# Altium schematic sheet OffsetAmplifier.SchDoc
size 193 x 146 mm; DocumentNumber: 7; SheetNumber: 7; SheetTotal: 11
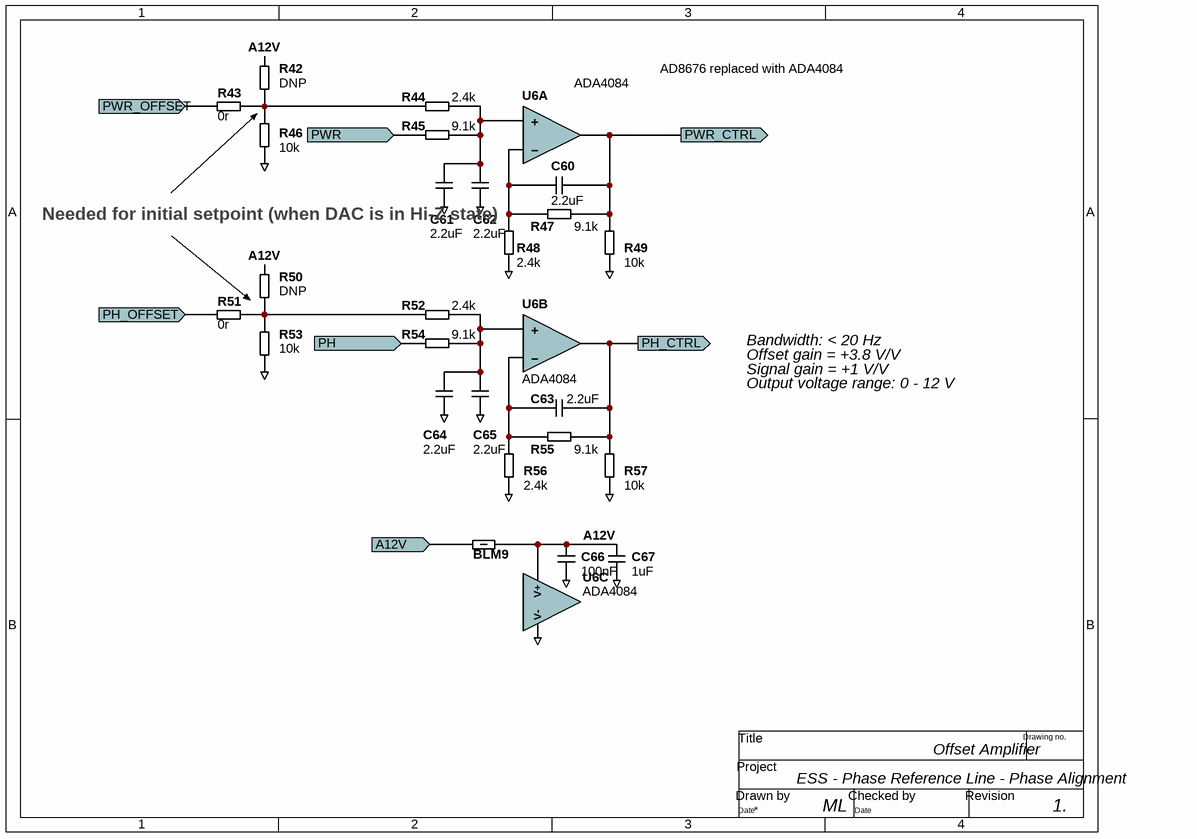
[diagram p0: OffsetAmplifier.SchDoc]

## Parts
BLM9  120 Ohms @ 100MHz  [0402-Inductor]  (value not drawn)
C60  2.2uF  [0805-Capacitor]
C61  2.2uF  [0805-Capacitor]
C62  2.2uF  [0805-Capacitor]
C63  2.2uF  [0805-Capacitor]
C64  2.2uF  [0805-Capacitor]
C65  2.2uF  [0805-Capacitor]
C66  100nF  [0402-Capacitor]
C67  1uF  [0805-Capacitor]
R42  DNP  [0402-RESISTOR]  (no BOM)
R43  0r  [0402-RESISTOR]
R44  2.4k  [0402-RESISTOR]
R45  9.1k  [0402-RESISTOR]
R46  10k  [0402-RESISTOR]
R47  9.1k  [0402-RESISTOR]
R48  2.4k  [0402-RESISTOR]
R49  10k  [0402-RESISTOR]
R50  DNP  [0402-RESISTOR]  (no BOM)
R51  0r  [0402-RESISTOR]
R52  2.4k  [0402-RESISTOR]
R53  10k  [0402-RESISTOR]
R54  9.1k  [0402-RESISTOR]
R55  9.1k  [0402-RESISTOR]
R56  2.4k  [0402-RESISTOR]
R57  10k  [0402-RESISTOR]
U6  ADA4084  [SOIC8]  (parts A,B,C of 3)

## Ports
A12V (in), PH (in), PH_CTRL (out), PH_OFFSET (in), PWR (in), PWR_CTRL (out), PWR_OFFSET (in)

## Nets
GND: C61.2 C62.2 C64.2 C65.2 C66.2 C67.2 R46.1 R48.1 R49.1 R53.1 R56.1 R57.1 U6.4(V-)
A12V: BLM9.1 C66.1 C67.1 R42.2 R50.2 U6.8(V+)
A12V: BLM9.2 ; port A12V  [a separate net that carries the same name]
PH: R54.1 ; port PH
PH_CTRL: C63.2 R55.2 R57.2 U6.7(BOut) ; port PH_CTRL
PH_OFFSET: R51.1 ; port PH_OFFSET
PWR: R45.1 ; port PWR
PWR_CTRL: C60.2 R47.2 R49.2 U6.1(Aout) ; port PWR_CTRL
PWR_OFFSET: R43.1 ; port PWR_OFFSET
NetC60_1: C60.1 R47.1 R48.2 U6.2(-A)
NetC61_1: C61.1 C62.1 R44.2 R45.2 U6.3(+A)
NetC63_1: C63.1 R55.1 R56.2 U6.6(-B)
NetC64_1: C64.1 C65.1 R52.2 R54.2 U6.5(+B)
NetR42_1: R42.1 R43.2 R44.1 R46.2
NetR50_1: R50.1 R51.2 R52.1 R53.2

## Notes on the sheet
- AD8676 replaced with ADA4084
- Needed for initial setpoint (when DAC is in Hi-Z state)
- Bandwidth: < 20 Hz
- Offset gain = +3.8 V/V
- Signal gain = +1 V/V
- Output voltage range: 0 - 12 V
- ESS - Phase Reference Line - Phase Alignment
- Offset Amplifier
- ML
- 1.
- Title
- Project
- Drawing no.
- Date
- Drawn by
- Checked by
- Revision

## Library data of the parts
BLM9 = BLM15AX121SZ1D: 120 Ohms @ 100MHz 1 Power, Signal Line Ferrite Bead 0402 (1005 Metric) 700mA 130mOhm; Case: 0402; Supplier 1: Digi-Key; Supplier Part Number 1: 490-16510-1-ND; HelpURL: https://www.murata.com/en-us/products/productdata/8796748677150/QNFA9118.pdf
C60-C65 C67 = C_0805: Capacitor 0805; Tolerance: ±20%; Voltage Rating: 16V; Dielectric: X7R/C0G; Case: 0805
  C60-C65: Value: 2.2uF
  C67: Value: 1uF
C66 = C_0402: Capacitor 0402; Tolerance: ±20%; Voltage Rating: 16V; Dielectric: X7R/C0G; Value: 100nF; Case: 0402
R42 R50 = R_0402: Resistor 0402; Value: 10k; Tolerance: ±1%; Case: 0402
R43-R49 R51-R57 = R_0402: Resistor 0402; Tolerance: ±1%; Case: 0402
  R43 R51: Value: 0r
  R44 R48 R52 R56: Value: 2.4k
  R45 R47 R54 R55: Value: 9.1k
  R46 R49 R53 R57: Value: 10k
U6 = ADA4084: DUAL OP AMP; HelpURL: https://www.analog.com/media/en/technical-documentation/data-sheets/ADA4084-1_4084-2_4084-4.pdf; Supplier 1: Digi-Key; Supplier Part Number 1: ADA4084-2ARZ